# EAGLE schematic SensorStick (EAGLE 9.6.2)
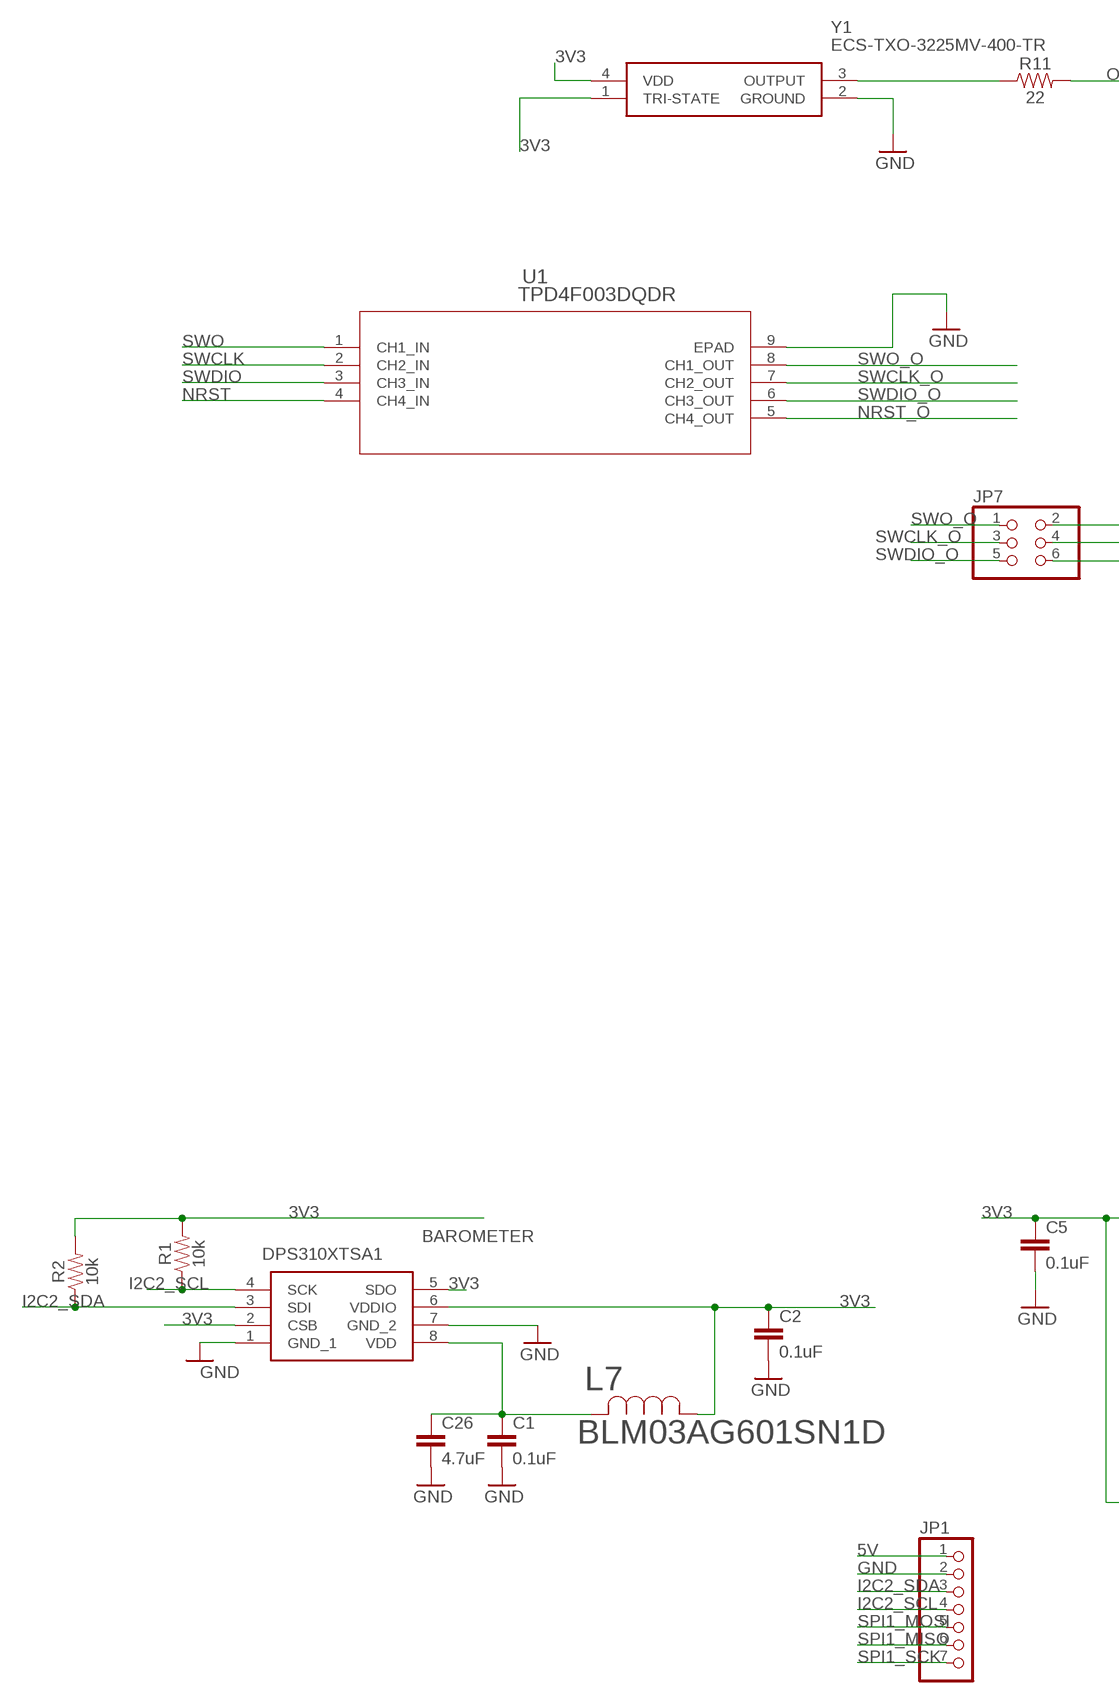
[diagram p0: schematic, sheet 1, part 1 of 2]
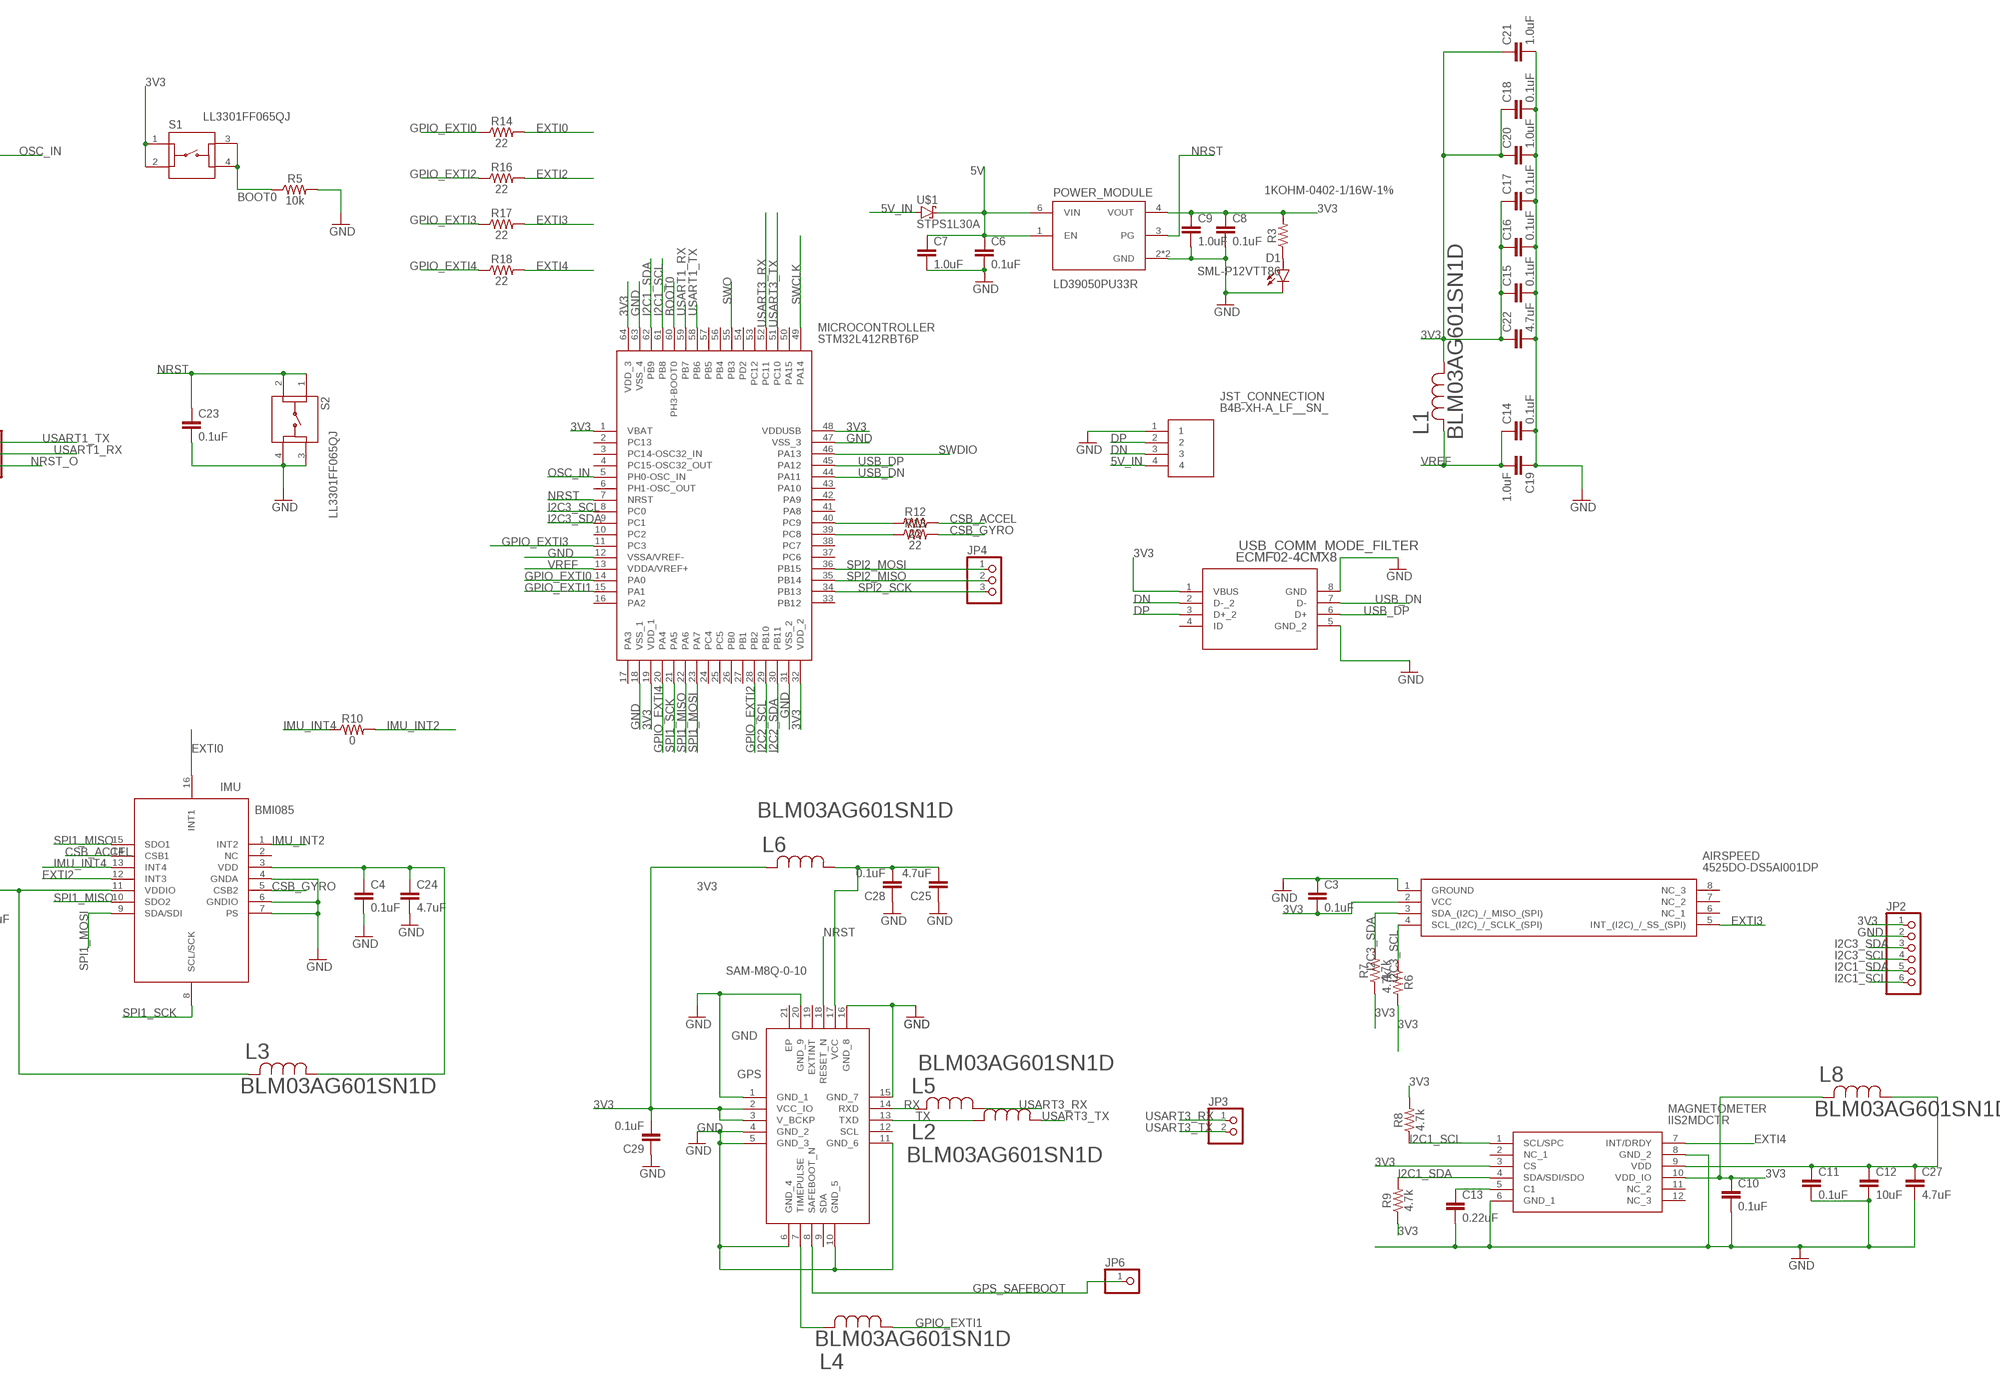
[diagram p1: schematic, sheet 1, part 2 of 2]

## Parts
AIRSPEED  4525DO-DS5AI001DP  [4525DO-DS...P]
BAROMETER  DPS310XTSA1  [DPS310XTSA1]
C1  0.1uF  0.1UF-0402-6.3V-10%-X7R  [0402]
C2  0.1uF  0.1UF-0402-6.3V-10%-X7R  [0402]
C3  0.1uF  0.1UF-0402-6.3V-10%-X7R  [0402]
C4  0.1uF  0.1UF-0402-6.3V-10%-X7R  [0402]
C5  0.1uF  0.1UF-0402-6.3V-10%-X7R  [0402]
C6  0.1uF  0.1UF-0402-6.3V-10%-X7R  [0402]
C7  1.0uF  1.0UF-0402-16V-10%  [0402]
C8  0.1uF  0.1UF-0402-6.3V-10%-X7R  [0402]
C9  1.0uF  1.0UF-0402-16V-10%  [0402]
C10  0.1uF  0.1UF-0402-6.3V-10%-X7R  [0402]
C11  0.1uF  0.1UF-0402-6.3V-10%-X7R  [0402]
C12  10uF  10UF-0603-6.3V-20%  [0603]
C13  0.22uF  0.22UF-0603-25V-10%  [0603]
C14  0.1uF  0.1UF-0603-25V-5%  [0603]
C15  0.1uF  0.1UF-0603-25V-5%  [0603]
C16  0.1uF  0.1UF-0603-25V-5%  [0603]
C17  0.1uF  0.1UF-0603-25V-5%  [0603]
C18  0.1uF  0.1UF-0603-25V-5%  [0603]
C19  1.0uF  1.0UF-0805-25V-10%  [0805]
C20  1.0uF  1.0UF-0805-25V-10%  [0805]
C21  1.0uF  1.0UF-0805-25V-10%  [0805]
C22  4.7uF  4.7UF0603  [0603]
C23  0.1uF  0.1UF-0603-25V-5%  [0603]
C24  4.7uF  4.7UF0603  [0603]
C25  4.7uF  4.7UF0603  [0603]
C26  4.7uF  4.7UF0603  [0603]
C27  4.7uF  4.7UF0603  [0603]
C28  0.1uF  0.1UF-0402-16V-10%  [0402]
C29  0.1uF  0.1UF-0402-16V-10%  [0402]
D1  SML-P12VTT86  [LED_SML-P11UTT86R]
GPS  SAM-M8Q-0-10  [SAMM8Q010]
IMU  BMI085  [BMI085]
JP1  PINHD-1X7  [1X07]
JP2  PINHD-1X6  [1X06]
JP3  PINHD-1X2  [1X02]
JP4  PINHD-1X3  [1X03]
JP6  PINHD-1X1  [1X01]
JP7  PINHD-2X3  [2X03]
JST_CONNECTION  B4B-XH-A_LF__SN_  [B4BXHALFSN]
L1  BLM03AG601SN1D  [IND_BLM03_0201_MUR]
L2  BLM03AG601SN1D  [IND_BLM03_0201_MUR]
L3  BLM03AG601SN1D  [IND_BLM03_0201_MUR]
L4  BLM03AG601SN1D  [IND_BLM03_0201_MUR]
L5  BLM03AG601SN1D  [IND_BLM03_0201_MUR]
L6  BLM03AG601SN1D  [IND_BLM03_0201_MUR]
L7  BLM03AG601SN1D  [IND_BLM03_0201_MUR]
L8  BLM03AG601SN1D  [IND_BLM03_0201_MUR]
MAGNETOMETER  IIS2MDCTR  [IIS2MDCTR]
MICROCONTROLLER  STM32L412RBT6P  [QFP50P1200X1200X160-64N]
POWER_MODULE  LD39050PU33R  [SON95P300X300X100-7N]
R1  10k  10KOHM-0402-1/16W-1%  [0402]
R2  10k  10KOHM-0402-1/16W-1%  [0402]
R3  1KOHM-0402-1/16W-1%  [0402]
R5  10k  10KOHM-0603-1/10W-1%  [0603]
R6  4.7k  4.7KOHM-0603-1/10W-1%  [0603]
R7  4.7k  4.7KOHM-0603-1/10W-1%  [0603]
R8  4.7k  4.7KOHM-0603-1/10W-1%  [0603]
R9  4.7k  4.7KOHM-0603-1/10W-1%  [0603]
R10  0  0OHM-0603-1/10W-5%  [0603]
R11  22  22OHM-0402-1/10W-1%  [0402]
R12  22  22OHM-0402-1/10W-1%  [0402]
R13  22  22OHM-0402-1/10W-1%  [0402]
R14  22  22OHM-0402-1/10W-1%  [0402]
R16  22  22OHM-0402-1/10W-1%  [0402]
R17  22  22OHM-0402-1/10W-1%  [0402]
R18  22  22OHM-0402-1/10W-1%  [0402]
S1  LL3301FF065QJ  [LL3301FF065QJ]
S2  LL3301FF065QJ  [LL3301FF065QJ]
U1  TPD4F003DQDR  [DQD8_1P2X0P4]
U$1  STPS1L30A  [DIOM5226X223N]
USB_COMM_MODE_FILTER  ECMF02-4CMX8  [MICRO_QFN-8L_STM]
Y1  ECS-TXO-3225MV-400-TR  [ECSTXO3225MV400TR]

## Nets
3V3: AIRSPEED.2(VCC) BAROMETER.2(CSB) BAROMETER.5(SDO) BAROMETER.6(VDDIO) C2.1 C3.2 C5.1 C8.1 C9.1 C10.1 C15.1 C16.1 C17.1 C18.1 C20.1 C21.1 C22.1 C29.2 GPS.2(VCC_IO) GPS.3(V_BCKP) IMU.11(VDDIO) JP2.1 L1.1 L3.2 L6.2 L7.1 L8.2 MAGNETOMETER.3(CS) MAGNETOMETER.10(VDD_IO) MICROCONTROLLER.1(VBAT) MICROCONTROLLER.19(VDD_1) MICROCONTROLLER.32(VDD_2) MICROCONTROLLER.48(VDDUSB) MICROCONTROLLER.64(VDD_3) POWER_MODULE.4(VOUT) R1.2 R2.2 R3.2 R6.2 R7.1 R8.2 R9.1 S1.1 S1.2 USB_COMM_MODE_FILTER.1(VBUS) Y1.1(TRI-STATE) Y1.4(VDD)
5V: C6.1 C7.1 JP1.1 POWER_MODULE.1(EN) POWER_MODULE.6(VIN) U$1.1(C)
5V_IN: JST_CONNECTION.4 U$1.2(A)
BOOT0: MICROCONTROLLER.60(PH3-BOOT0) R5.1 S1.3 S1.4
CSB_ACCEL: IMU.14(CSB1) R12.2
CSB_GYRO: IMU.5(CSB2) R13.2
DN: JST_CONNECTION.3 USB_COMM_MODE_FILTER.2(D-_2)
DP: JST_CONNECTION.2 USB_COMM_MODE_FILTER.3(D+_2)
EXTI0: IMU.16(INT1) R14.2
EXTI2: IMU.12(INT3) R16.2
EXTI3: AIRSPEED.5(INT_(I2C)_/_SS_(SPI)) R17.2
EXTI4: MAGNETOMETER.7(INT/DRDY) R18.2
GND: AIRSPEED.1(GROUND) BAROMETER.1(GND_1) BAROMETER.7(GND_2) C1.2 C2.2 C3.1 C4.2 C5.2 C6.2 C7.2 C8.2 C9.2 C10.2 C11.2 C12.2 C13.2 C14.2 C15.2 C16.2 C17.2 C18.2 C19.1 C20.2 C21.2 C22.2 C23.2 C24.2 C25.1 C26.2 C27.2 C28.1 C29.1 D1.C GPS.1(GND_1) GPS.4(GND_2) GPS.5(GND_3) GPS.6(GND_4) GPS.10(GND_5) GPS.11(GND_6) GPS.15(GND_7) GPS.16(GND_8) GPS.20(GND_9) IMU.4(GNDA) IMU.6(GNDIO) IMU.7(PS) JP1.2 JP2.2 JST_CONNECTION.1 MAGNETOMETER.6(GND_1) MAGNETOMETER.8(GND_2) MICROCONTROLLER.12(VSSA/VREF-) MICROCONTROLLER.18(VSS_1) MICROCONTROLLER.31(VSS_2) MICROCONTROLLER.47(VSS_3) MICROCONTROLLER.63(VSS_4) POWER_MODULE.2(GND) POWER_MODULE.7(GND) R5.2 S2.3 S2.4 U1.9(EPAD) USB_COMM_MODE_FILTER.5(GND_2) USB_COMM_MODE_FILTER.8(GND) Y1.2(GROUND)
GPIO_EXTI0: MICROCONTROLLER.14(PA0) R14.1
GPIO_EXTI1: L4.1 MICROCONTROLLER.15(PA1)
GPIO_EXTI2: MICROCONTROLLER.28(PB2) R16.1
GPIO_EXTI3: MICROCONTROLLER.11(PC3) R17.1
GPIO_EXTI4: MICROCONTROLLER.20(PA4) R18.1
GPS_SAFEBOOT: GPS.8(SAFEBOOT_N) JP6.1
I2C1_SCL: JP2.6 MAGNETOMETER.1(SCL/SPC) MICROCONTROLLER.61(PB8) R8.1
I2C1_SDA: JP2.5 MAGNETOMETER.4(SDA/SDI/SDO) MICROCONTROLLER.62(PB9) R9.2
I2C2_SCL: BAROMETER.4(SCK) JP1.4 MICROCONTROLLER.29(PB10) R1.1
I2C2_SDA: BAROMETER.3(SDI) JP1.3 MICROCONTROLLER.30(PB11) R2.1
I2C3_SCL: AIRSPEED.4(SCL_(I2C)_/_SCLK_(SPI)) JP2.4 MICROCONTROLLER.8(PC0) R6.1
I2C3_SDA: AIRSPEED.3(SDA_(I2C)_/_MISO_(SPI)) JP2.3 MICROCONTROLLER.9(PC1) R7.2
IMU_INT2: IMU.1(INT2) R10.2
IMU_INT4: IMU.13(INT4) R10.1
N$1: R11.1 Y1.3(OUTPUT)
N$2: GPS.7(TIMEPULSE) L4.2
N$3: MICROCONTROLLER.40(PC9) R12.1
N$4: MICROCONTROLLER.39(PC8) R13.1
N$5: D1.A R3.1
N$6: BAROMETER.8(VDD) C1.1 C26.1 L7.2
N$7: C13.1 MAGNETOMETER.5(C1)
N$8: C4.1 C24.1 IMU.3(VDD) L3.1
N$9: C25.2 C28.2 GPS.17(VCC) L6.1
N$10: C11.1 C12.1 C27.1 L8.1 MAGNETOMETER.9(VDD)
NRST: C23.1 GPS.18(RESET_N) MICROCONTROLLER.7(NRST) POWER_MODULE.3(PG) S2.1 S2.2 U1.4(CH4_IN)
NRST_O: JP7.6 U1.5(CH4_OUT)
OSC_IN: MICROCONTROLLER.5(PH0-OSC_IN) R11.2
RX: GPS.14(RXD) L5.2
SPI1_MISO: IMU.10(SDO2) IMU.15(SDO1) JP1.6 MICROCONTROLLER.22(PA6)
SPI1_MOSI: IMU.9(SDA/SDI) JP1.5 MICROCONTROLLER.23(PA7)
SPI1_SCK: IMU.8(SCL/SCK) JP1.7 MICROCONTROLLER.21(PA5)
SPI2_MISO: JP4.2 MICROCONTROLLER.35(PB14)
SPI2_MOSI: JP4.1 MICROCONTROLLER.36(PB15)
SPI2_SCK: JP4.3 MICROCONTROLLER.34(PB13)
SWCLK: MICROCONTROLLER.49(PA14) U1.2(CH2_IN)
SWCLK_O: JP7.3 U1.7(CH2_OUT)
SWDIO: MICROCONTROLLER.46(PA13) U1.3(CH3_IN)
SWDIO_O: JP7.5 U1.6(CH3_OUT)
SWO: MICROCONTROLLER.55(PB3) U1.1(CH1_IN)
SWO_O: JP7.1 U1.8(CH1_OUT)
TX: GPS.13(TXD) L2.2
USART1_RX: JP7.4 MICROCONTROLLER.59(PB7)
USART1_TX: JP7.2 MICROCONTROLLER.58(PB6)
USART3_RX: JP3.1 L5.1 MICROCONTROLLER.52(PC11)
USART3_TX: JP3.2 L2.1 MICROCONTROLLER.51(PC10)
USB_DN: MICROCONTROLLER.44(PA11) USB_COMM_MODE_FILTER.7(D-)
USB_DP: MICROCONTROLLER.45(PA12) USB_COMM_MODE_FILTER.6(D+)
VREF: C14.1 C19.2 L1.2 MICROCONTROLLER.13(VDDA/VREF+)
Unconnected: AIRSPEED.6(NC_1) AIRSPEED.7(NC_2) AIRSPEED.8(NC_3) GPS.9(SDA) GPS.12(SCL) GPS.19(EXTINT) GPS.21(EP) IMU.2(NC) MAGNETOMETER.2(NC_1) MAGNETOMETER.11(NC_2) MAGNETOMETER.12(NC_3) MICROCONTROLLER.2(PC13) MICROCONTROLLER.3(PC14-OSC32_IN) MICROCONTROLLER.4(PC15-OSC32_OUT) MICROCONTROLLER.6(PH1-OSC_OUT) MICROCONTROLLER.10(PC2) MICROCONTROLLER.16(PA2) MICROCONTROLLER.17(PA3) MICROCONTROLLER.24(PC4) MICROCONTROLLER.25(PC5) MICROCONTROLLER.26(PB0) MICROCONTROLLER.27(PB1) MICROCONTROLLER.33(PB12) MICROCONTROLLER.37(PC6) MICROCONTROLLER.38(PC7) MICROCONTROLLER.41(PA8) MICROCONTROLLER.42(PA9) MICROCONTROLLER.43(PA10) MICROCONTROLLER.50(PA15) MICROCONTROLLER.53(PC12) MICROCONTROLLER.54(PD2) MICROCONTROLLER.56(PB4) MICROCONTROLLER.57(PB5) USB_COMM_MODE_FILTER.4(ID)

## Library data of the parts
AIRSPEED = 4525DO-DS5AI001DP:4525DO-DS5AI001DP: Differential Pressure Sensor 1PSI Dual Barbs Source: Datasheet <http://www.te.com/commerce/DocumentDelivery/DDEController?Action=srchrtrv&DocNm=MS4525DO&DocType=DS&DocLang=English>; ARROW_PART_NUMBER: 4525DO-DS5AI001DP; ARROW_PRICE-STOCK: https://www.arrow.com/en/products/4525do-ds5ai001dp/te-connectivity; DESCRIPTION: Differential Pressure Sensor 1PSI Dual Barbs; HEIGHT: mm; MANUFACTURER_NAME: TE Connectivity; MANUFACTURER_PART_NUMBER: 4525DO-DS5AI001DP; MOUSER_PART_NUMBER: 824-4525DODS5AI001DP; MOUSER_PRICE-STOCK: https://www.mouser.co.uk/ProductDetail/Measurement-Specialties/4525DO-DS5AI001DP?qs=oFx6pF86PmDUpUCTX7loEA%3D%3D
BAROMETER = DPS310XTSA1:DPS310XTSA1: INFINEON - DPS310XTSA1 - DIGITAL PRESSURE SENSOR, 1200HPA, VLGA-8 Source: Datasheet <https://www.infineon.com/dgdl/Infineon-DPS310-DS-v01_00-EN.pdf?fileId=5546d462576f34750157750826c42242>; ARROW_PART_NUMBER: DPS310XTSA1; ARROW_PRICE-STOCK: https://www.arrow.com/en/products/dps310xtsa1/infineon-technologies-ag?region=nac; DESCRIPTION: INFINEON - DPS310XTSA1 - DIGITAL PRESSURE SENSOR, 1200HPA, VLGA-8; HEIGHT: 1.01mm; MANUFACTURER_NAME: Infineon; MANUFACTURER_PART_NUMBER: DPS310XTSA1; MOUSER_PART_NUMBER: 726-DPS310XTSA1; MOUSER_PRICE-STOCK: https://www.mouser.co.uk/ProductDetail/Infineon-Technologies/DPS310XTSA1?qs=uuTTuBTXn66Ynca8WHwycg%3D%3D
C1 C2 C4-C6 C8 C10 C11 = SparkFun-Capacitors:0.1UF: 0.1µF ceramic capacitors A capacitor is a passive two-terminal electrical component used to store electrical energy temporarily in an electric field.; PROD_ID: CAP-14993
C3 = SparkFun-Capacitors:0.1UF: 0.1µF ceramic capacitors A capacitor is a passive two-terminal electrical component used to store electrical energy temporarily in an electric field.; PROD_ID: CAP-14993; SPICEPREFIX: C
C7 C9 = SparkFun-Capacitors:1.0UF: 1µF ceramic capacitors A capacitor is a passive two-terminal electrical component used to store electrical energy temporarily in an electric field.; PROD_ID: CAP-12417
C12 = SparkFun-Capacitors:10UF: 10.0µF ceramic capacitors A capacitor is a passive two-terminal electrical component used to store electrical energy temporarily in an electric field.; PROD_ID: CAP-11015
C13 = SparkFun-Capacitors:0.22UF: 0.22µF ceramic capacitors A capacitor is a passive two-terminal electrical component used to store electrical energy temporarily in an electric field.; PROD_ID: CAP-07822
C14-C18 C23 = SparkFun-Capacitors:0.1UF: 0.1µF ceramic capacitors A capacitor is a passive two-terminal electrical component used to store electrical energy temporarily in an electric field.; PROD_ID: CAP-08604
C19-C21 = SparkFun-Capacitors:1.0UF: 1µF ceramic capacitors A capacitor is a passive two-terminal electrical component used to store electrical energy temporarily in an electric field.; PROD_ID: CAP-08064
C22 C24-C27 = SparkFun-Capacitors:4.7UF: 4.7µF ceramic capacitors A capacitor is a passive two-terminal electrical component used to store electrical energy temporarily in an electric field.; PROD_ID: CAP-08280
C28 C29 = SparkFun-Capacitors:0.1UF: 0.1µF ceramic capacitors A capacitor is a passive two-terminal electrical component used to store electrical energy temporarily in an electric field.; PROD_ID: CAP-12416
D1 = ce-capstone:SML-P12VTT86: SML-P1 Series Red 0402 Clear 60 mcd 2 V Surface Mount PICOLED LED; AVAILABILITY: Unavailable; DESCRIPTION: Red 630nm LED Indication - Discrete 2V 0402 _1006 Metric_; MF: Rohm; MP: SML-P12VTT86; PACKAGE: 0402 Rohm; PRICE: None
GPS = SAM-M8Q-0-10:SAM-M8Q-0-10: GNSS antenna module Source: Datasheet <https://www.u-blox.com/sites/default/files/SAM-M8Q_DataSheet_(UBX-16012619).pdf>; DESCRIPTION: GNSS antenna module; HEIGHT: 3mm; MANUFACTURER_NAME: U-Blox; MANUFACTURER_PART_NUMBER: SAM-M8Q-0-10; MOUSER_PART_NUMBER: N/A; MOUSER_PRICE-STOCK: https://www.mouser.co.uk/ProductDetail/u-blox/SAM-M8Q-0-10?qs=KUoIvG%2F9IlYKGQbFkOKljQ%3D%3D
IMU = BMI085:BMI085: IMUs - Inertial Measurement Units High-performance IMU BMI085 for virtual and augmented reality applications Source: Datasheet <https://ae-bst.resource.bosch.com/media/_tech/media/datasheets/BST-BMI085-DS001.pdf>; ARROW_PART_NUMBER: BMI085; ARROW_PRICE-STOCK: https://www.arrow.com/en/products/bmi085/bosch; DESCRIPTION: IMUs - Inertial Measurement Units High-performance IMU BMI085 for virtual and augmented reality applications; HEIGHT: 1mm; MANUFACTURER_NAME: Bosch Sensortec; MANUFACTURER_PART_NUMBER: BMI085; MOUSER_PART_NUMBER: 262-BMI085; MOUSER_PRICE-STOCK: https://www.mouser.co.uk/ProductDetail/Bosch-Sensortec/BMI085?qs=y6ZabgHbY%252ByGCM8LfWZyqA%3D%3D
JP1 = pinhead:PINHD-1X7: PIN HEADER
JP2 = pinhead:PINHD-1X6: PIN HEADER
JP3 = pinhead:PINHD-1X2: PIN HEADER
JP4 = pinhead:PINHD-1X3: PIN HEADER
JP6 = pinhead:PINHD-1X1: PIN HEADER
JP7 = pinhead:PINHD-2X3: PIN HEADER
JST_CONNECTION = B4B-XH-A_LF__SN_:B4B-XH-A_LF__SN_: CONN HEADER VERT 4POS 2.5MM Source: Datasheet <https://datasheet.lcsc.com/szlcsc/JST-Sales-America-B4B-XH-A-LF-SN_C144395.pdf>; ARROW_PART_NUMBER: B4B-XH-A(LF)(SN); ARROW_PRICE-STOCK: https://www.arrow.com/en/products/b4b-xh-a-lf-sn/jst-manufacturing?region=europe; DESCRIPTION: CONN HEADER VERT 4POS 2.5MM; HEIGHT: 7mm; MANUFACTURER_NAME: JST (JAPAN SOLDERLESS TERMINALS); MANUFACTURER_PART_NUMBER: B4B-XH-A(LF)(SN)
L1-L8 = BLM03AG601SN1D:BLM03AG601SN1D; COPYRIGHT: Copyright (C) 2023 Ultra Librarian. All rights reserved.; DIGI-KEY_PART_NUMBER_1: 490-5164-1-ND; DIGI-KEY_PART_NUMBER_2: 490-5164-2-ND; DIGI-KEY_PART_NUMBER_3: 490-5164-6-ND; MANUFACTURER_PART_NUMBER: BLM03AG601SN1D; MFR_NAME: Murata
MAGNETOMETER = IIS2MDCTR:IIS2MDCTR: STMICROELECTRONICS - IIS2MDCTR - MEMS MODULE, 3-AXIS MAGNETOMETER, LGA-12 Source: Datasheet <https://www.st.com/resource/en/datasheet/iis2mdc.pdf>; ARROW_PART_NUMBER: IIS2MDCTR; ARROW_PRICE-STOCK: https://www.arrow.com/en/products/iis2mdctr/stmicroelectronics; DESCRIPTION: STMICROELECTRONICS - IIS2MDCTR - MEMS MODULE, 3-AXIS MAGNETOMETER, LGA-12; HEIGHT: 0.7mm; MANUFACTURER_NAME: STMicroelectronics; MANUFACTURER_PART_NUMBER: IIS2MDCTR; MOUSER_PART_NUMBER: 511-IIS2MDCTR; MOUSER_PRICE-STOCK: https://www.mouser.co.uk/ProductDetail/STMicroelectronics/IIS2MDCTR?qs=1mbolxNpo8ems1K%2FRdQzXg%3D%3D
MICROCONTROLLER = STM32L412RBT6P:STM32L412RBT6P: ARM Microcontrollers - MCU Source: Datasheet <https://www.st.com/resource/en/datasheet/stm32l412c8.pdf>; DESCRIPTION: ARM Microcontrollers - MCU; HEIGHT: 1.6mm; MANUFACTURER_NAME: STMicroelectronics; MANUFACTURER_PART_NUMBER: STM32L412RBT6P; MOUSER_PART_NUMBER: 511-STM32L412RBT6P; MOUSER_PRICE-STOCK: https://www.mouser.co.uk/ProductDetail/STMicroelectronics/STM32L412RBT6P?qs=l7cgNqFNU1hh%252BU1wOZs5Xg%3D%3D
POWER_MODULE = ce-capstone:LD39050PU33R: LD39050 Series 500 mA 3.3 V Fixed Low Noise LDO Voltage Regulator - DFN-6; AVAILABILITY: Unavailable; DESCRIPTION: Linear Voltage Regulator IC 1 Output 500mA 6-DFN _3x3_; MF: STMicroelectronics; MP: LD39050PU33R; PACKAGE: DFN-6 STMicroelectronics; PRICE: None
R1 R2 = SparkFun-Resistors:10KOHM: 10kΩ resistor A resistor is a passive two-terminal electrical component that implements electrical resistance as a circuit element. Resistors act to reduce current flow, and, at the same time, act to lower voltage levels within circuits. - Wikipedia; PROD_ID: RES-14241
R3 = SparkFun-Resistors:1KOHM: 1kΩ resistor A resistor is a passive two-terminal electrical component that implements electrical resistance as a circuit element. Resistors act to reduce current flow, and, at the same time, act to lower voltage levels within circuits. - Wikipedia; PROD_ID: RES-14342
R5 = SparkFun-Resistors:10KOHM: 10kΩ resistor A resistor is a passive two-terminal electrical component that implements electrical resistance as a circuit element. Resistors act to reduce current flow, and, at the same time, act to lower voltage levels within circuits. - Wikipedia; PROD_ID: RES-00824
R6-R9 = SparkFun-Resistors:4.7KOHM: 4.7kΩ resistor A resistor is a passive two-terminal electrical component that implements electrical resistance as a circuit element. Resistors act to reduce current flow, and, at the same time, act to lower voltage levels within circuits. - Wikipedia; PROD_ID: RES-07857
R10 = SparkFun-Resistors:0OHM: 0Ω resistor A resistor is a passive two-terminal electrical component that implements electrical resistance as a circuit element. Resistors act to reduce current flow, and, at the same time, act to lower voltage levels within circuits. - Wikipedia; PROD_ID: RES-08609
R11-R14 R16-R18 = SparkFun-Resistors:22OHM: 22Ω resistor A resistor is a passive two-terminal electrical component that implements electrical resistance as a circuit element. Resistors act to reduce current flow, and, at the same time, act to lower voltage levels within circuits. - Wikipedia; PROD_ID: RES-12427
S1 S2 = ce-capstone:LL3301FF065QJ: Pushbutton Switches 50mA 12VDC F065 7.0mm J-Lead Source: Datasheet <https://componentsearchengine.com/Datasheets/1/LL3301FF065QJ.pdf>; DESCRIPTION: Pushbutton Switches 50mA 12VDC F065 7.0mm J-Lead; HEIGHT: 7.3mm; MANUFACTURER_NAME: E-Switch; MANUFACTURER_PART_NUMBER: LL3301FF065QJ; MOUSER_PART_NUMBER: 612-LL3301FF065QJ; MOUSER_PRICE-STOCK: https://www.mouser.com/Search/Refine.aspx?Keyword=612-LL3301FF065QJ
U1 = TPD4F003DQDR:TPD4F003DQDR; COPYRIGHT: Copyright (C) 2023 Ultra Librarian. All rights reserved.; DIGI-KEY_PART_NUMBER_1: 296-25817-1-ND; DIGI-KEY_PART_NUMBER_2: 296-25817-2-ND; DIGI-KEY_PART_NUMBER_3: 296-25817-6-ND; DIGI-KEY_PART_NUMBER_4: 2156-TPD4F003DQDR-ND; MANUFACTURER_PART_NUMBER: TPD4F003DQDR; MFR_NAME: Texas Instruments
U$1 = ce-capstone:STPS1L30A
USB_COMM_MODE_FILTER = ECMF02-4CMX8:ECMF02-4CMX8; COPYRIGHT: Copyright (C) 2023 Ultra Librarian. All rights reserved.; DIGI-KEY_PART_NUMBER_1: 497-13420-2-ND; DIGI-KEY_PART_NUMBER_2: 497-13420-1-ND; DIGI-KEY_PART_NUMBER_3: 497-13420-6-ND; MANUFACTURER_PART_NUMBER: ECMF02-4CMX8; MFR_NAME: STMicroelectronics
Y1 = SamacSys_Parts:ECS-TXO-3225MV-400-TR: TCXO Oscillators 40.000 MHZ Multi-Volt +1.7 3.6V HCMOS TCXO +/-2.5 ppm -30 +85 C 3.2x 2.5mm RoHS Source: Datasheet <https://ecsxtal.com/store/pdf/ECS-TXO-3225MV.pdf>; DESCRIPTION: TCXO Oscillators 40.000 MHZ Multi-Volt +1.7 3.6V HCMOS TCXO +/-2.5 ppm -30 +85 C 3.2x 2.5mm RoHS; HEIGHT: 1.2mm; MANUFACTURER_NAME: ECS; MANUFACTURER_PART_NUMBER: ECS-TXO-3225MV-400-TR